# Altium schematic sheet SAMD21.SchDoc
size A
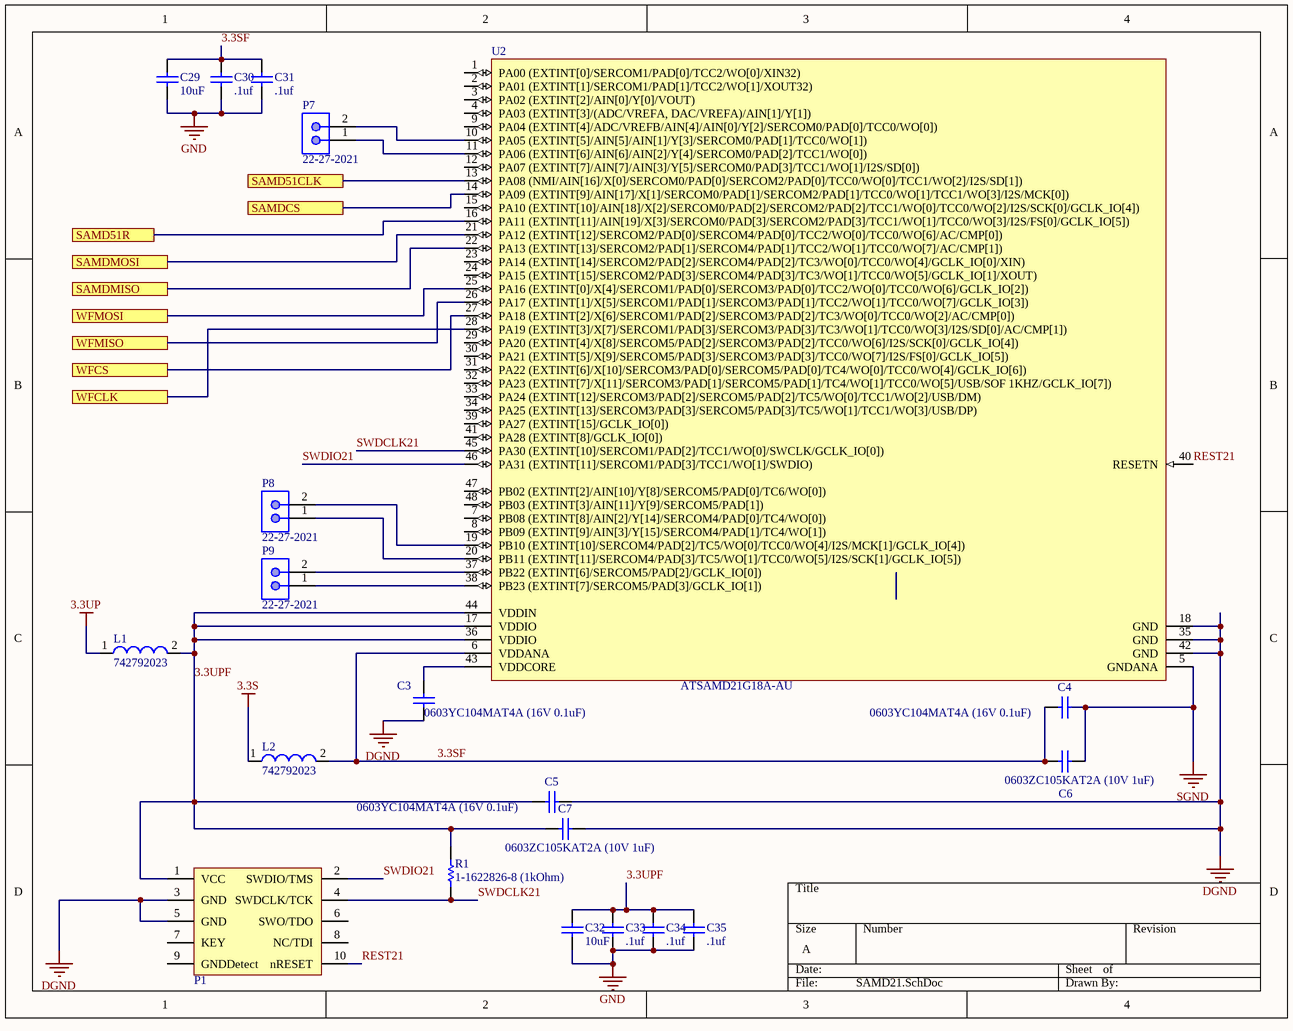
[diagram p0: SAMD21.SchDoc]

## Parts
C3  0603YC104MAT4A (16V 0.1uF)  [CAPC1608X90X35LL15T15]
C4  0603YC104MAT4A (16V 0.1uF)  [CAPC1608X90X35LL15T15]
C5  0603YC104MAT4A (16V 0.1uF)  [CAPC1608X90X35LL15T15]
C6  0603ZC105KAT2A (10V 1uF)  [CAPC1608X90X35LL15T15]
C7  0603ZC105KAT2A (10V 1uF)  [CAPC1608X90X35LL15T15]
C29  10uF  [CAPC1608X90X35NL10T15]
C30  .1uf  [CAPC2013X94X50NL20T25]
C31  .1uf  [CAPC2013X94X50NL20T25]
C32  10uF  [CAPC1608X90X35NL10T15]
C33  .1uf  [CAPC2013X94X50NL20T25]
C34  .1uf  [CAPC2013X94X50NL20T25]
C35  .1uf  [CAPC2013X94X50NL20T25]
L1  742792023  [SMD-0805]
L2  742792023  [SMD-0805]
P1  3220-10-0100-00 Pin connector for Cotex Programmers  (value not drawn)
P7  22-27-2021  [MOLX-22-27-2021_V]
P8  22-27-2021  [MOLX-22-27-2021_V]
P9  22-27-2021  [MOLX-22-27-2021_V]
R1  1-1622826-8 (1kOhm)  [RESC1005X40X25ML10T10]
U2  ATSAMD21G18A-AU  [ATML-TQFP48_M]

## Ports
SAMD51CLK, SAMD51R, SAMDCS, SAMDMISO, SAMDMOSI, WFCLK, WFCS, WFMISO, WFMOSI

## Nets
3.3S: L2.1
3.3UP: L1.1
DGND: C3.2 C5.1 C7.2 P1.3(GND) P1.5(GND) U2.18(GND) U2.35(GND) U2.42(GND)
GND: C29.1 C30.1 C31.1 C32.1 C33.1 C34.1 C35.1
SGND: C4.1 C6.2 U2.5(GNDANA)
3.3SF: C4.2 C6.1 C29.2 C30.2 C31.2 L2.2 U2.6(VDDANA)
3.3UPF: C5.2 C7.1 C32.2 C33.2 C34.2 C35.2 L1.2 P1.1(VCC) R1.2 U2.17(VDDIO) U2.36(VDDIO) U2.44(VDDIN)
REST21: P1.10(nRESET) U2.40(RESETN)
SAMD51CLK: U2.13(PA08_(NMI/AIN[16]/X[0]/SERCOM0/PAD[0]/SERCOM2/PAD[0]/TCC0/WO[0]/TCC1/WO[2]/I2S/SD[1])) ; port SAMD51CLK
SAMD51R: U2.16(PA11_(EXTINT[11]/AIN[19]/X[3]/SERCOM0/PAD[3]/SERCOM2/PAD[3]/TCC1/WO[1]/TCC0/WO[3]/I2S/FS[0]/GCLK_IO[5])) ; port SAMD51R
SAMDCS: U2.14(PA09_(EXTINT[9]/AIN[17]/X[1]/SERCOM0/PAD[1]/SERCOM2/PAD[1]/TCC0/WO[1]/TCC1/WO[3]/I2S/MCK[0])) ; port SAMDCS
SAMDMISO: U2.22(PA13_(EXTINT[13]/SERCOM2/PAD[1]/SERCOM4/PAD[1]/TCC2/WO[1]/TCC0/WO[7]/AC/CMP[1])) ; port SAMDMISO
SAMDMOSI: U2.21(PA12_(EXTINT[12]/SERCOM2/PAD[0]/SERCOM4/PAD[0]/TCC2/WO[0]/TCC0/WO[6]/AC/CMP[0])) ; port SAMDMOSI
SWDCLK21: P1.4(SWDCLK/TCK) R1.1 U2.45(PA30_(EXTINT[10]/SERCOM1/PAD[2]/TCC1/WO[0]/SWCLK/GCLK_IO[0]))
SWDIO21: P1.2(SWDIO/TMS) U2.46(PA31_(EXTINT[11]/SERCOM1/PAD[3]/TCC1/WO[1]/SWDIO))
WFCLK: U2.28(PA19_(EXTINT[3]/X[7]/SERCOM1/PAD[3]/SERCOM3/PAD[3]/TC3/WO[1]/TCC0/WO[3]/I2S/SD[0]/AC/CMP[1])) ; port WFCLK
WFCS: U2.27(PA18_(EXTINT[2]/X[6]/SERCOM1/PAD[2]/SERCOM3/PAD[2]/TC3/WO[0]/TCC0/WO[2]/AC/CMP[0])) ; port WFCS
WFMISO: U2.26(PA17_(EXTINT[1]/X[5]/SERCOM1/PAD[1]/SERCOM3/PAD[1]/TCC2/WO[1]/TCC0/WO[7]/GCLK_IO[3])) ; port WFMISO
WFMOSI: U2.25(PA16_(EXTINT[0]/X[4]/SERCOM1/PAD[0]/SERCOM3/PAD[0]/TCC2/WO[0]/TCC0/WO[6]/GCLK_IO[2])) ; port WFMOSI
NetC3_1: C3.1 U2.43(VDDCORE)
NetP7_1: P7.1 U2.11(PA06_(EXTINT[6]/AIN[6]/AIN[2]/Y[4]/SERCOM0/PAD[2]/TCC1/WO[0]))
NetP7_2: P7.2 U2.10(PA05_(EXTINT[5]/AIN[5]/AIN[1]/Y[3]/SERCOM0/PAD[1]/TCC0/WO[1]))
NetP8_1: P8.1 U2.20(PB11_(EXTINT[11]/SERCOM4/PAD[3]/TC5/WO[1]/TCC0/WO[5]/I2S/SCK[1]/GCLK_IO[5]))
NetP8_2: P8.2 U2.19(PB10_(EXTINT[10]/SERCOM4/PAD[2]/TC5/WO[0]/TCC0/WO[4]/I2S/MCK[1]/GCLK_IO[4]))
NetP9_1: P9.1 U2.38(PB23_(EXTINT[7]/SERCOM5/PAD[3]/GCLK_IO[1]))
NetP9_2: P9.2 U2.37(PB22_(EXTINT[6]/SERCOM5/PAD[2]/GCLK_IO[0]))

Not connected (* = marked no-connect by the designer): P1 6(SWO/TDO) 7(KEY) 8(NC/TDI) 9(GNDDetect); U2 1(PA00_(EXTINT[0]/SERCOM1/PAD[0]/TCC2/WO[0]/XIN32)) 2(PA01_(EXTINT[1]/SERCOM1/PAD[1]/TCC2/WO[1]/XOUT32)) 3(PA02_(EXTINT[2]/AIN[0]/Y[0]/VOUT)) 4(PA03_(EXTINT[3]/(ADC/VREFA,_DAC/VREFA)/AIN[1]/Y[1])) 7(PB08_(EXTINT[8]/AIN[2]/Y[14]/SERCOM4/PAD[0]/TC4/WO[0])) 8(PB09_(EXTINT[9]/AIN[3]/Y[15]/SERCOM4/PAD[1]/TC4/WO[1])) 9(PA04_(EXTINT[4]/ADC/VREFB/AIN[4]/AIN[0]/Y[2]/SERCOM0/PAD[0]/TCC0/WO[0])) 12(PA07_(EXTINT[7]/AIN[7]/AIN[3]/Y[5]/SERCOM0/PAD[3]/TCC1/WO[1]/I2S/SD[0])) 15(PA10_(EXTINT[10]/AIN[18]/X[2]/SERCOM0/PAD[2]/SERCOM2/PAD[2]/TCC1/WO[0]/TCC0/WO[2]/I2S/SCK[0]/GCLK_IO[4])) 23(PA14_(EXTINT[14]/SERCOM2/PAD[2]/SERCOM4/PAD[2]/TC3/WO[0]/TCC0/WO[4]/GCLK_IO[0]/XIN)) 24(PA15_(EXTINT[15]/SERCOM2/PAD[3]/SERCOM4/PAD[3]/TC3/WO[1]/TCC0/WO[5]/GCLK_IO[1]/XOUT)) 29(PA20_(EXTINT[4]/X[8]/SERCOM5/PAD[2]/SERCOM3/PAD[2]/TCC0/WO[6]/I2S/SCK[0]/GCLK_IO[4])) 30(PA21_(EXTINT[5]/X[9]/SERCOM5/PAD[3]/SERCOM3/PAD[3]/TCC0/WO[7]/I2S/FS[0]/GCLK_IO[5])) 31(PA22_(EXTINT[6]/X[10]/SERCOM3/PAD[0]/SERCOM5/PAD[0]/TC4/WO[0]/TCC0/WO[4]/GCLK_IO[6])) 32(PA23_(EXTINT[7]/X[11]/SERCOM3/PAD[1]/SERCOM5/PAD[1]/TC4/WO[1]/TCC0/WO[5]/USB/SOF_1KHZ/GCLK_IO[7])) 33(PA24_(EXTINT[12]/SERCOM3/PAD[2]/SERCOM5/PAD[2]/TC5/WO[0]/TCC1/WO[2]/USB/DM)) 34(PA25_(EXTINT[13]/SERCOM3/PAD[3]/SERCOM5/PAD[3]/TC5/WO[1]/TCC1/WO[3]/USB/DP)) 39(PA27_(EXTINT[15]/GCLK_IO[0])) 41(PA28_(EXTINT[8]/GCLK_IO[0])) 47(PB02_(EXTINT[2]/AIN[10]/Y[8]/SERCOM5/PAD[0]/TC6/WO[0])) 48(PB03_(EXTINT[3]/AIN[11]/Y[9]/SERCOM5/PAD[1]))

## Library data of the parts
C3-C5 = CMP-2006-02126-1: Manufacturer: AVX Interconnect / Elco; Part Number: 0603YC104MAT4A
C6 C7 = CMP-2006-04551-1: Manufacturer: AVX Interconnect / Elco; Part Number: 0603ZC105KAT2A
C29 C32 = CMP-2006-02792-1: Part Number: GRM188R60J106ME47D; Manufacturer: Murata
C30 C31 C33-C35 = CMP-2007-04454-1: Part Number: 0805YC104KAT2A; Manufacturer: AVX Interconnect / Elco
L1 L2 = CMP-0220-00030-1: SMD EMI Suppression Ferrite Bead WE-CBF, Z = 120 Ohm; Impedance: 120 Ohm; PackageDescription: Chip Inductor, 2-Leads, Body 2.0 x 1.2 mm; ComponentLink2URL: http://www.we-online.de/katalog/media/pdf/742792023.pdf; ComponentLink1Description: Manufacturer Link; ComponentLink2Description: Datasheet; DatasheetVersion: Dec-2005; PackageReference: SMD-0805; ComponentLink1URL: http://www.we-online.com; PackageVersion: 2005
P1 = 3220-10-0100-00: 3220-10-0100-00 Pin connector from DigiKey; ComponentLink1Description: 3220-10-0100-00; ComponentLink1URL: https://www.digikey.com/product-detail/en/cnc-tech/3220-10-0100-00/1175-1627-ND/3883661
P7-P9 = CMP-2000-05537-1: Male Header, Pitch 2.54 mm, 1 x 2 Position, Height 11.7 mm, Tail Length 3.56 mm, 0 to 75 degC, RoHS, Bulk; Manufacturer: Molex; PartNumber: 0022272021; Current rating: 4A; Package Version: Rev. BC, 02/2012; Voltage rating: 250V; No. of Positions: 2; Pitch: 2.54mm; No. of Rows: 1; Orientation: Vertical; Operating temperature: 0°Cto+75°C; Manufacturer URL: http://www.molex.com/; Mounting Technology: ThroughHole; Housing material: Nylon(UL94V-0); Package Description: 2-Leads Header, Body 5.08 x 5.8 mm, Pitch 2.54 mm; Voltage - Max: 250V; Datasheet URL: http://www.molex.com/pdm_docs/sd/022272021_sd.pdf; Package Reference: 22-27-2021; Contact material: Tinplatedbrass; Current - Max: 4A; Datasheet Version: Rev. F, 06/2009
R1 = CMP-2002-04643-1: Manufacturer: TE Connectivity / AMP; Part Number: 1-1622826-8
U2 = CMP-2100-03585-1: SMART ARM-Based Microcontroller, 1.62 to 3.63 V, 256 KB Flash, 32 KB SRAM, -40 to 85 degC, 48-Pin TQFP, RoHS, Tray; Manufacturer: Atmel; Max Frequency: 48MHz; Number of Timers/Counters: 6; Max Supply Voltage: 3.63V; Min Supply Voltage: 1.62V; Packaging: Tray; Datasheet Version: Rev. N, 10/2016; Datasheet URL: http://www.atmel.com/images/atmel-42181-sam-d21_datasheet.pdf; REACH SVHC: NoSVHC; RoHSCompliant: true; Max Operating Temperature: 85degC; Manufacturer URL: http://www.atmel.com/; Contact Plating: Tin; Frequency: 48MHz; Package Description: 48-Pin Thin Profile Plastic Quad Flat Package, Body 7 x 7 mm, Pitch 0.5 mm; Package Reference: TQFP48; Lead Free: LeadFree; Number of Pins: 48; Min Operating Temperature: -40degC; Case/Package: TQFP; Mount: SurfaceMount